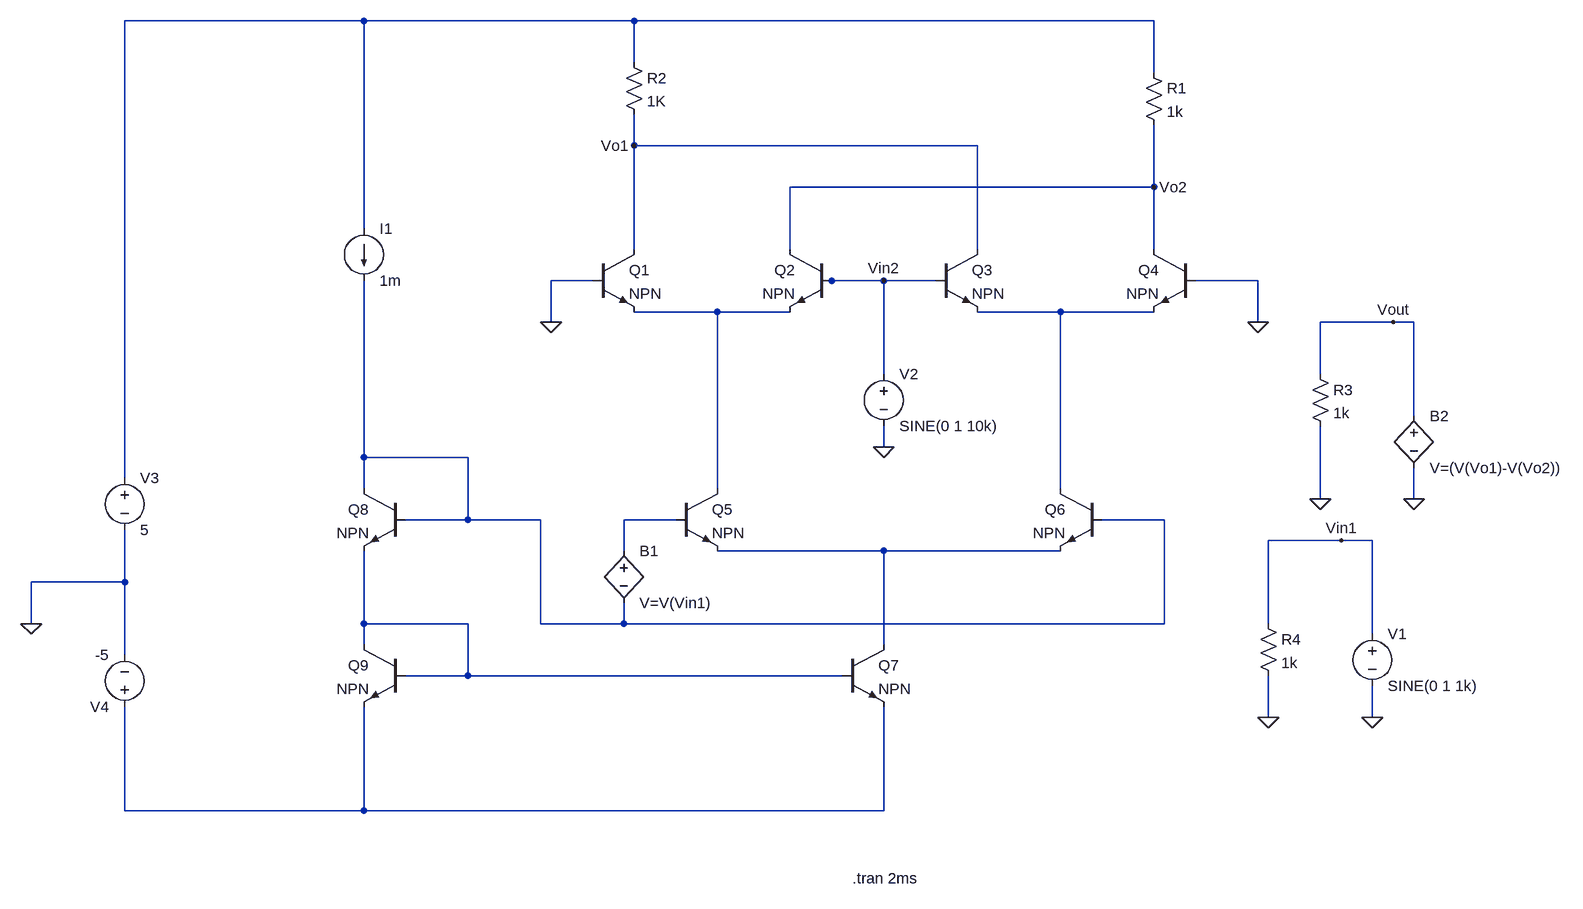
[diagram p0: schematic Gilbert Cell.asc]
Gilbert Cell.asc, the LTspice schematic file:
Version 4
SHEET 1 2212 1064
WIRE -352 -272 -720 -272
WIRE 64 -272 -352 -272
WIRE 864 -272 64 -272
WIRE 64 -208 64 -272
WIRE 864 -192 864 -272
WIRE 64 -80 64 -128
WIRE 592 -80 64 -80
WIRE 864 -16 864 -112
WIRE 864 -16 304 -16
WIRE -352 48 -352 -272
WIRE 64 80 64 -80
WIRE 304 80 304 -16
WIRE 592 80 592 -80
WIRE 864 80 864 -16
WIRE 0 128 -64 128
WIRE 368 128 352 128
WIRE 448 128 368 128
WIRE 528 128 448 128
WIRE 1024 128 928 128
WIRE 192 176 64 176
WIRE 304 176 192 176
WIRE 720 176 592 176
WIRE 864 176 720 176
WIRE -64 192 -64 128
WIRE 1024 192 1024 128
WIRE 1232 192 1120 192
WIRE 1264 192 1232 192
WIRE 448 272 448 128
WIRE 1120 272 1120 192
WIRE 1264 336 1264 192
WIRE 448 384 448 352
WIRE -352 400 -352 128
WIRE -192 400 -352 400
WIRE -720 432 -720 -272
WIRE -352 448 -352 400
WIRE 192 448 192 176
WIRE 720 448 720 176
WIRE 1120 464 1120 352
WIRE 1264 464 1264 416
WIRE -192 496 -192 400
WIRE -192 496 -288 496
WIRE -80 496 -192 496
WIRE 128 496 48 496
WIRE 880 496 784 496
WIRE 1152 528 1040 528
WIRE 1200 528 1152 528
WIRE 48 544 48 496
WIRE 448 544 192 544
WIRE 720 544 448 544
WIRE -720 592 -720 512
WIRE -720 592 -864 592
WIRE -864 656 -864 592
WIRE -352 656 -352 544
WIRE -192 656 -352 656
WIRE -80 656 -80 496
WIRE 48 656 48 624
WIRE 48 656 -80 656
WIRE 880 656 880 496
WIRE 880 656 48 656
WIRE 1040 656 1040 528
WIRE 1200 672 1200 528
WIRE -352 688 -352 656
WIRE 448 688 448 544
WIRE -720 704 -720 592
WIRE -192 736 -192 656
WIRE -192 736 -288 736
WIRE 384 736 -192 736
WIRE 1040 800 1040 736
WIRE 1200 800 1200 752
WIRE -720 944 -720 784
WIRE -352 944 -352 784
WIRE -352 944 -720 944
WIRE 448 944 448 784
WIRE 448 944 -352 944
FLAG -64 192 0
FLAG 1024 192 0
FLAG 448 384 0
FLAG -864 656 0
FLAG 64 -80 Vo1
FLAG 864 -16 Vo2
FLAG 448 128 Vin2
FLAG 1232 192 Vout
FLAG 1152 528 Vin1
FLAG 1120 464 0
FLAG 1200 800 0
FLAG 1040 800 0
FLAG 1264 464 0
SYMBOL npn 0 80 R0
SYMATTR InstName Q1
SYMBOL npn 368 80 M0
SYMATTR InstName Q2
SYMBOL npn 528 80 R0
SYMATTR InstName Q3
SYMBOL npn 928 80 M0
SYMATTR InstName Q4
SYMBOL npn 128 448 R0
SYMATTR InstName Q5
SYMBOL npn 784 448 M0
SYMATTR InstName Q6
SYMBOL npn 384 688 R0
SYMATTR InstName Q7
SYMBOL npn -288 448 M0
SYMATTR InstName Q8
SYMBOL npn -288 688 M0
SYMATTR InstName Q9
SYMBOL voltage 448 256 R0
WINDOW 123 0 0 Left 0
WINDOW 39 0 0 Left 0
SYMATTR InstName V2
SYMATTR Value SINE(0 1 10k)
SYMBOL voltage -720 416 R0
WINDOW 123 0 0 Left 0
WINDOW 39 0 0 Left 0
SYMATTR InstName V3
SYMATTR Value 5
SYMBOL voltage -720 800 R180
WINDOW 123 0 0 Left 0
WINDOW 39 0 0 Left 0
SYMATTR InstName V4
SYMATTR Value -5
SYMBOL voltage 1200 656 R0
WINDOW 123 0 0 Left 0
WINDOW 39 0 0 Left 0
SYMATTR InstName V1
SYMATTR Value SINE(0 1 1k)
SYMBOL bv 48 528 R0
SYMATTR InstName B1
SYMATTR Value V=V(Vin1)
SYMBOL bv 1264 320 R0
SYMATTR InstName B2
SYMATTR Value V=(V(Vo1)-V(Vo2))
SYMBOL res 848 -208 R0
SYMATTR InstName R1
SYMATTR Value 1k
SYMBOL res 48 -224 R0
SYMATTR InstName R2
SYMATTR Value 1K
SYMBOL current -352 48 R0
WINDOW 123 0 0 Left 0
WINDOW 39 0 0 Left 0
SYMATTR InstName I1
SYMATTR Value 1m
SYMBOL res 1104 256 R0
SYMATTR InstName R3
SYMATTR Value 1k
SYMBOL res 1024 640 R0
SYMATTR InstName R4
SYMATTR Value 1k
TEXT 400 1048 Left 2 !.tran 2ms

The netlist it stands for:
* Gilbert Cell.asc
Q1 Vo1 0 N002 0 NPN
Q2 Vo2 Vin2 N002 0 NPN
Q3 Vo1 Vin2 N003 0 NPN
Q4 Vo2 0 N003 0 NPN
Q5 N002 N005 N006 0 NPN
Q6 N003 N004 N006 0 NPN
Q7 N006 N007 N008 0 NPN
Q8 N004 N004 N007 0 NPN
Q9 N007 N007 N008 0 NPN
V2 Vin2 0 SINE(0 1 10k)
V3 N001 0 5
V4 N008 0 -5
V1 Vin1 0 SINE(0 1 1k)
B1 N005 N004 V=V(Vin1)
B2 Vout 0 V=(V(Vo1)-V(Vo2))
R1 N001 Vo2 1k
R2 N001 Vo1 1K
I1 N001 N004 1m
R3 Vout 0 1k
R4 Vin1 0 1k
.model NPN NPN
.model PNP PNP
.lib standard.bjt
.tran 2ms
.backanno
.end